# Altium schematic sheet Lab7-8_CH2.SchDoc
size B; DrawnBy: Aaron Huinink; SheetNumber: 3; SheetTotal: 5
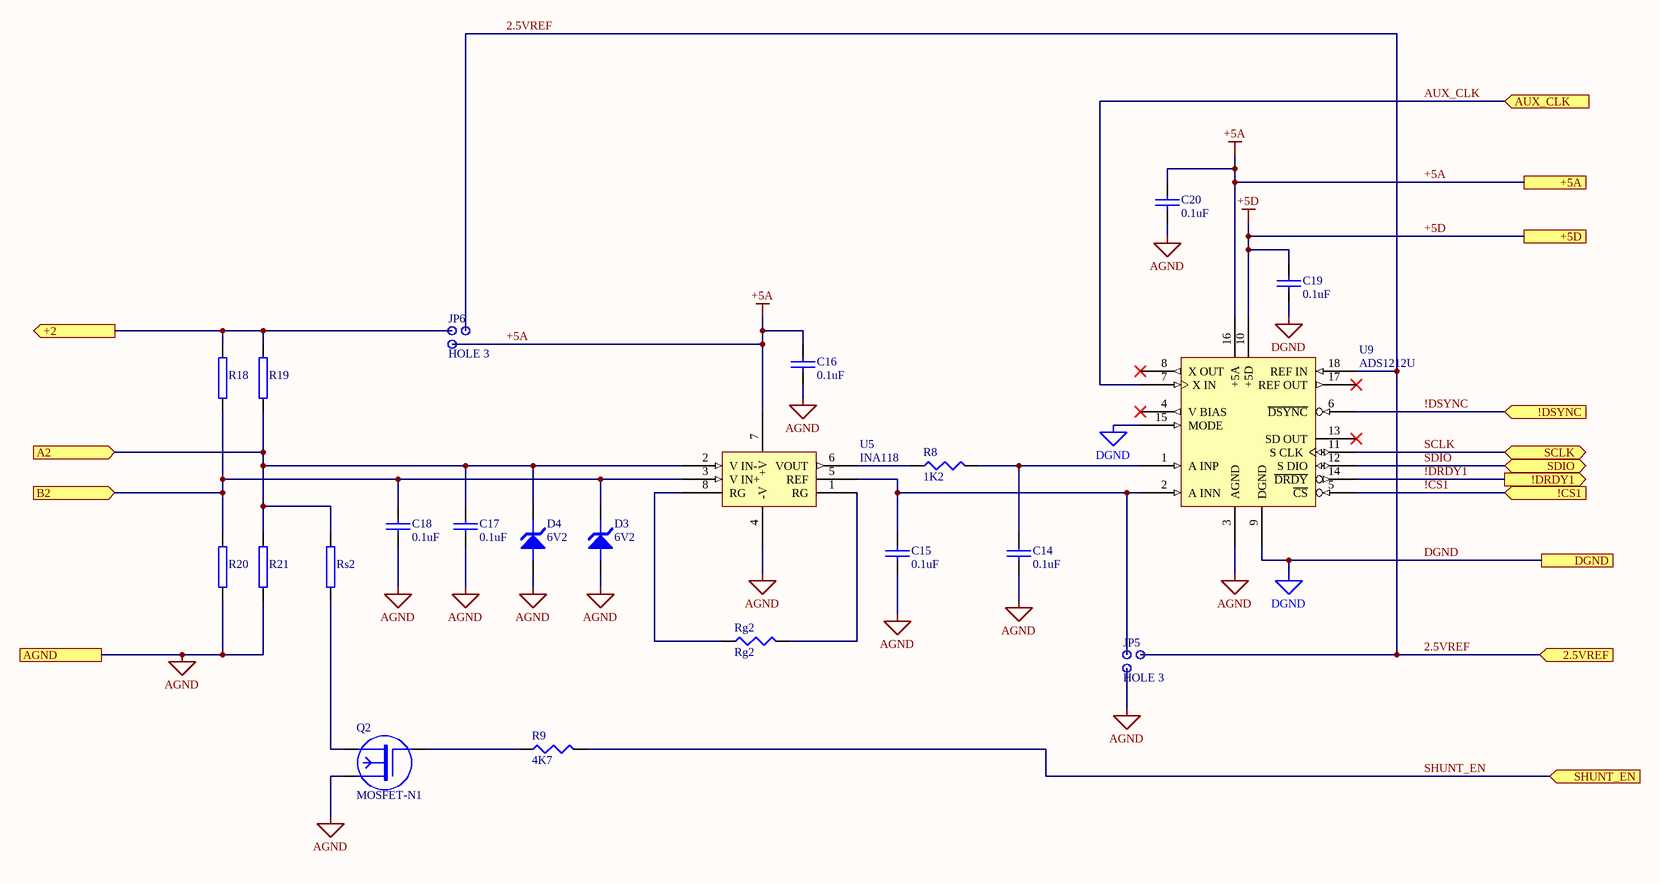
[diagram p0: Lab7-8_CH2.SchDoc]

## Parts
C14  0.1uF  [0805]
C15  0.1uF  [0805]
C16  0.1uF  [0805]
C17  0.1uF  [0805]
C18  0.1uF  [0805]
C19  0.1uF  [0805]
C20  0.1uF  [0805]
D3  6V2  [SOD-123]
D4  6V2  [SOD-123]
JP5  HOLE 3  [RAD0.1A]
JP6  HOLE 3  [RAD0.1A]
Q2  MOSFET-N1  [SOT-23]
R8  1K2  [0805]
R9  4K7  [0805]
R18  bridge R  [bridge resistor]  (value not drawn)
R19  bridge R  [bridge resistor]  (value not drawn)
R20  bridge R  [bridge resistor]  (value not drawn)
R21  bridge R  [bridge resistor]  (value not drawn)
Rg2  Rg2  [0805]
Rs2  bridge R  [bridge resistor]  (value not drawn)
U5  INA118  [SO-8]
U9  ADS1212U  [SOIC18]

## Ports
2.5VREF (in, see Lab7-8_TOP[4B], Lab7-8_CH1[5C], Lab7-8_CH3[6C], Lab7-8_CH4[6C]), !CS1 (in, see Lab7-8_TOP[4B]), !DRDY1 (out, see Lab7-8_TOP[4C]), !DSYNC (in, see Lab7-8_TOP[4B], Lab7-8_CH1[5B], Lab7-8_CH3[6B], Lab7-8_CH4[5B]), +2 (out, see Lab7-8_TOP[3B]), +5A (see Lab7-8_TOP[4B], Lab7-8_CH1[5B], Lab7-8_CH3[6B], Lab7-8_CH4[6B]), +5D (see Lab7-8_TOP[4B], Lab7-8_CH1[5B], Lab7-8_CH3[6B], Lab7-8_CH4[6B]), A2 (in, see Lab7-8_TOP[3B]), AGND (see Lab7-8_TOP[3C], Lab7-8_CH1[1C], Lab7-8_CH3[1C], Lab7-8_CH4[1C]), AUX_CLK (in, see Lab7-8_TOP[4C], Lab7-8_CH1[5A], Lab7-8_CH4[5A]), B2 (in, see Lab7-8_TOP[3B]), DGND (see Lab7-8_TOP[4B], Lab7-8_CH1[5C], Lab7-8_CH3[6C], Lab7-8_CH4[6C]), SCLK (bidir, see Lab7-8_TOP[4B], Lab7-8_CH1[5B], Lab7-8_CH3[6B], Lab7-8_CH4[5B]), SDIO (bidir, see Lab7-8_TOP[4B], Lab7-8_CH1[5B], Lab7-8_CH3[6B], Lab7-8_CH4[5B]), SHUNT_EN (in, see Lab7-8_TOP[4B], Lab7-8_CH1[5C], Lab7-8_CH3[6C], Lab7-8_CH4[6C])

## Nets
+5A: C16.1 C20.1 JP6.1 U5.7(+V) U9.16(+5A) ; port +5A  [also labelled +V]
+5D: C19.1 U9.10(+5D) ; port +5D
-V: C14.2 C15.2 C16.2 C17.2 C18.2 C20.2 D3.A D4.A JP5.1 Q2.2 R20.1 R21.1 U5.4(-V) U9.3(AGND) ; port AGND  [also labelled AGND]
DGND: C19.2 U9.9(DGND) U9.15(MODE) ; port DGND
2.5VREF: JP5.3 JP6.3 U9.18(REF_IN) ; port 2.5VREF
!CS1: U9.5(~{CS}) ; port !CS1
!DRDY1: U9.14(~{DRDY}) ; port !DRDY1
!DSYNC: U9.6(~{DSYNC}) ; port !DSYNC
+2: JP6.2 R18.2 R19.2 ; port +2
A2: C17.1 D4.K R19.1 R21.2 Rs2.2 U5.2(V_IN-) ; port A2
AUX_CLK: U9.7(X_IN) ; port AUX_CLK
B2: C18.1 D3.K R18.1 R20.2 U5.3(V_IN+) ; port B2
SCLK: U9.11(S_CLK) ; port SCLK
SDIO: U9.12(S_DIO) ; port SDIO
SHUNT_EN: R9.2 ; port SHUNT_EN
NetC14_1: C14.1 R8.2 U9.1(A_INP)
NetC15_1: C15.1 JP5.2 U5.5(REF) U9.2(A_INN)
NetQ2_1: Q2.1 R9.1
NetQ2_3: Q2.3 Rs2.1
NetR8_1: R8.1 U5.6(VOUT)
NetRg2_1: Rg2.1 U5.8(RG)
NetRg2_2: Rg2.2 U5.1(RG)

Not connected (* = marked no-connect by the designer): U9 4(V_BIAS)* 8(X_OUT)* 13(SD_OUT)* 17(REF_OUT)*

## Notes on the sheet
- Title
- Size:
- Date:
- A
- Number:
- Time:
- Revision:
- Sheet
- of
- File:

## Library data of the parts
C14-C20 = CAP
D3 D4 = ZENER3
R8 R9 Rg2 = RES1
R18-R21 Rs2 = RES2
U5 = INA118: Precision, Low Power Instrumentation Amplifier
U9 = ADS1212U(18): 22-Bit Analog-to-Digital Converter